# EAGLE design kmSigGenTiny_Schematics (EAGLE 9.4.2)
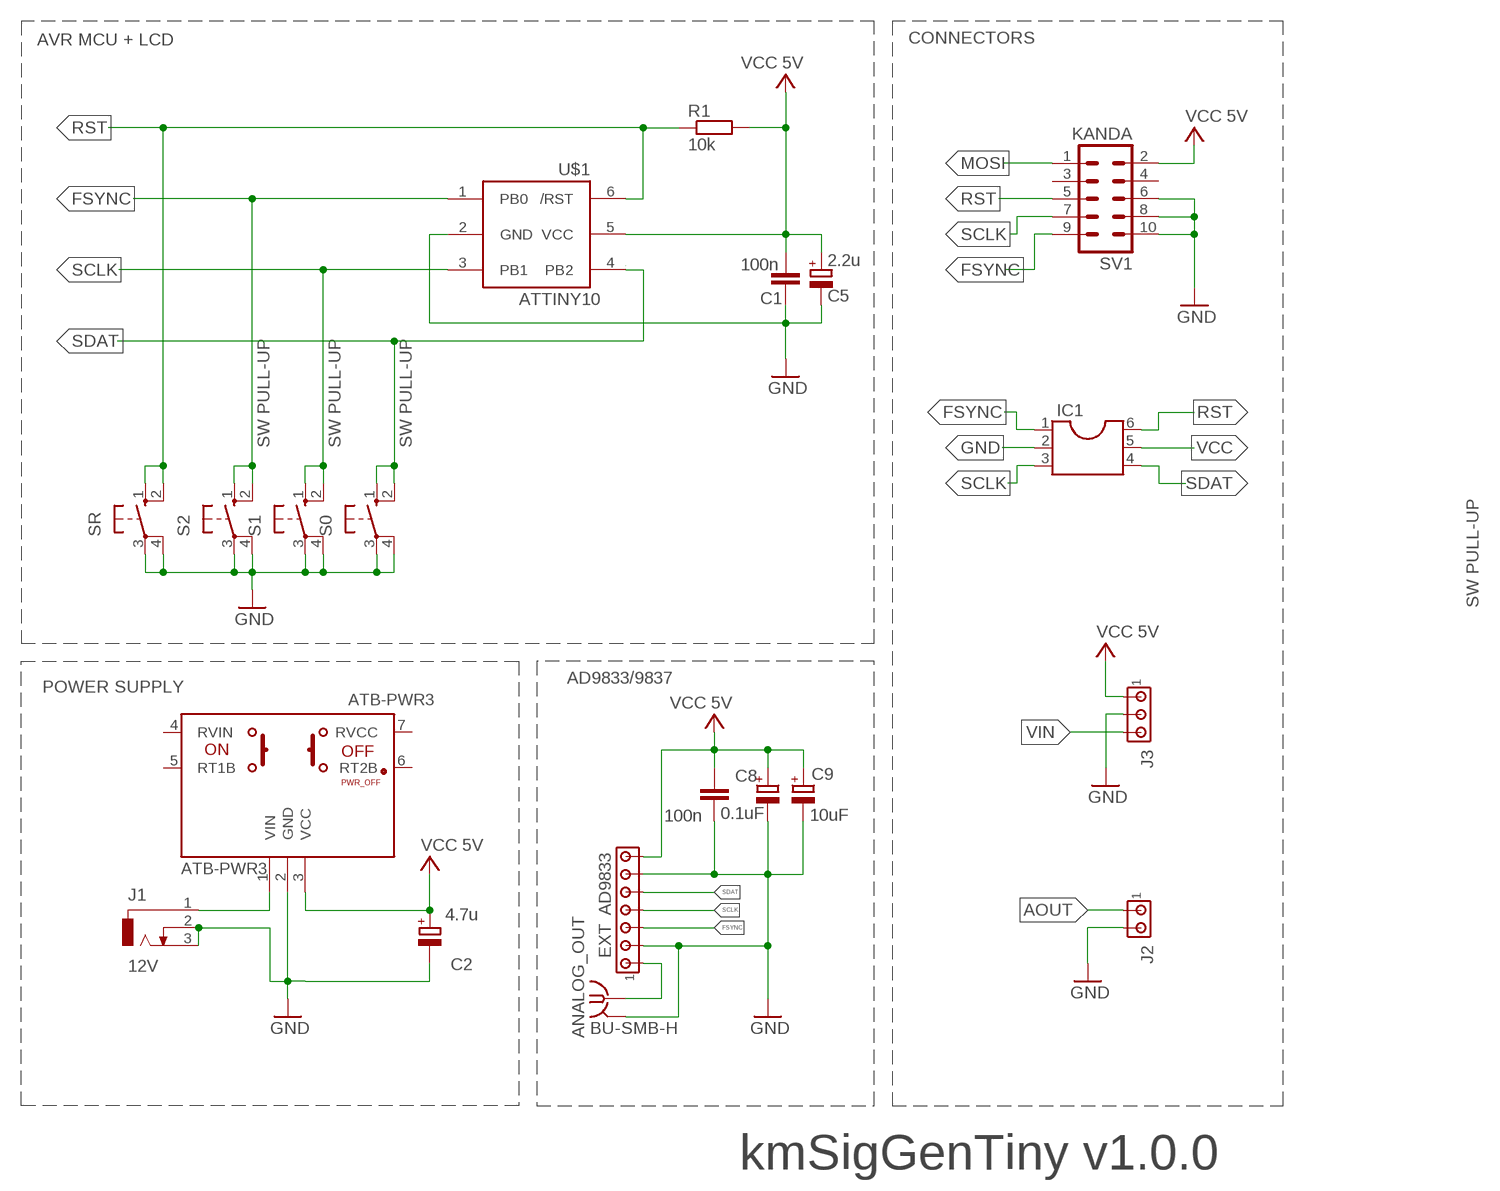
[diagram p0: schematic, sheet 1]

## Parts
ANALOG_OUT  BU-SMB-H  [BU-SMB-H]
ATB-PWR3  ATB-PWR3  [ATB-PWR3]
C1  100n  C2.5/4  [C2.5-4]
C2  4.7u  CPOL-EUB45181B  [B45181B]
C3  100n  C2.5/4  [C2.5-4]
C5  2.2u  CPOL-EUB45181B  [B45181B]
C8  0.1uF  CPOL-EUB45181B  [B45181B]
C9  10uF  CPOL-EUB45181B  [B45181B]
EXT  AD9833  MTA07-100  [10X07MTA]
IC1  DIL6  [DIL06]
J1  12V  DCJ0303  [DCJ0303]
J2  MTA02-100  [10X02MTA]
J3  MTA03-100  [10X03MTA]
R1  10k  R-EU_0207/10  [0207/10]
S0  10-XX  [B3F-10XX]
S1  10-XX  [B3F-10XX]
S2  10-XX  [B3F-10XX]
SR  10-XX  [B3F-10XX]
SV1  KANDA  ML10  [ML10]
U$1  ATTINY10  [SOT23-6]

## Nets
AOUT: ANALOG_OUT.1 EXT.1 J2.1
FSYNC: EXT.3 IC1.1 S2.1(S) S2.2(S1) SV1.9 U$1.1(PB0)
GND: ANALOG_OUT.2 ANALOG_OUT.3 ANALOG_OUT.4 ANALOG_OUT.5 ATB-PWR3.2(GND) C1.1 C2.- C3.1 C5.- C8.- C9.- EXT.2 EXT.6 IC1.2 J1.2 J1.3 J2.2 J3.2 S0.3(P) S0.4(P1) S1.3(P) S1.4(P1) S2.3(P) S2.4(P1) SR.3(P) SR.4(P1) SV1.6 SV1.8 SV1.10 U$1.2(GND)
MOSI: SV1.1
RST: IC1.6 R1.1 SR.1(S) SR.2(S1) SV1.5 U$1.6(/RST)
SCLK: EXT.4 IC1.3 S1.1(S) S1.2(S1) SV1.7 U$1.3(PB1)
SDAT: EXT.5 IC1.4 S0.1(S) S0.2(S1) U$1.4(PB2)
VCC: ATB-PWR3.3(VCC) C1.2 C2.+ C3.2 C5.+ C8.+ C9.+ EXT.7 IC1.5 J3.1 R1.2 SV1.2 U$1.5(VCC) ; supply symbol labelled VCC 5V
VIN: ATB-PWR3.1(VIN) J1.1 J3.3
Unconnected: ATB-PWR3.4(RVIN) ATB-PWR3.5(RT1B) ATB-PWR3.6(RT2B) ATB-PWR3.7(RVCC) SV1.3 SV1.4

## Notes on the sheet
- AVR MCU + LCD | CONNECTORS
- SW PULL-UP | SW PULL-UP | SW PULL-UP
- SW PULL-UP
- AD9833/9837
- POWER SUPPLY
- kmSigGenTiny v1.0.0

## Library data of the parts
ANALOG_OUT = con-coax:BU-SMB-H: FEMALE SMB CONNECTOR Radiall distributor RS 112-3003; OC_FARNELL: unknown; OC_NEWARK: unknown
ATB-PWR3 = _ATNEL:ATB-PWR3
C1 C3 = capacitor-wima:C: CAPACITOR naming: grid - package width
C2 C5 C8 C9 = rcl:CPOL-EU: POLARIZED CAPACITOR, European symbol; SPICEPREFIX: C
EXT = con-amp:MTA07-100: AMP connector
IC1 = ic-package:DIL6: Dual In Line / Socket
J1 = con-jack:DCJ0303: DC POWER JACK Source: DCJ0303.pdf; OC_FARNELL: unknown; OC_NEWARK: unknown
J2 = con-amp:MTA02-100: AMP connector
J3 = con-amp:MTA03-100: AMP connector
R1 = rcl:R-EU_: RESISTOR, European symbol; SPICEPREFIX: R
S0 S1 S2 SR = switch-omron:10-XX: OMRON SWITCH; MPN: B3F-1000; OC_FARNELL: 176432; OC_NEWARK: 36M3542
SV1 = con-ml:ML10: HARTING; OC_FARNELL: unknown; OC_NEWARK: unknown
U$1 = adafruit:ATTINY10: ATtiny4/5/9/10 8-bit Microcontroller with 512/1024 Bytes In-System Programmable Flash

## Board
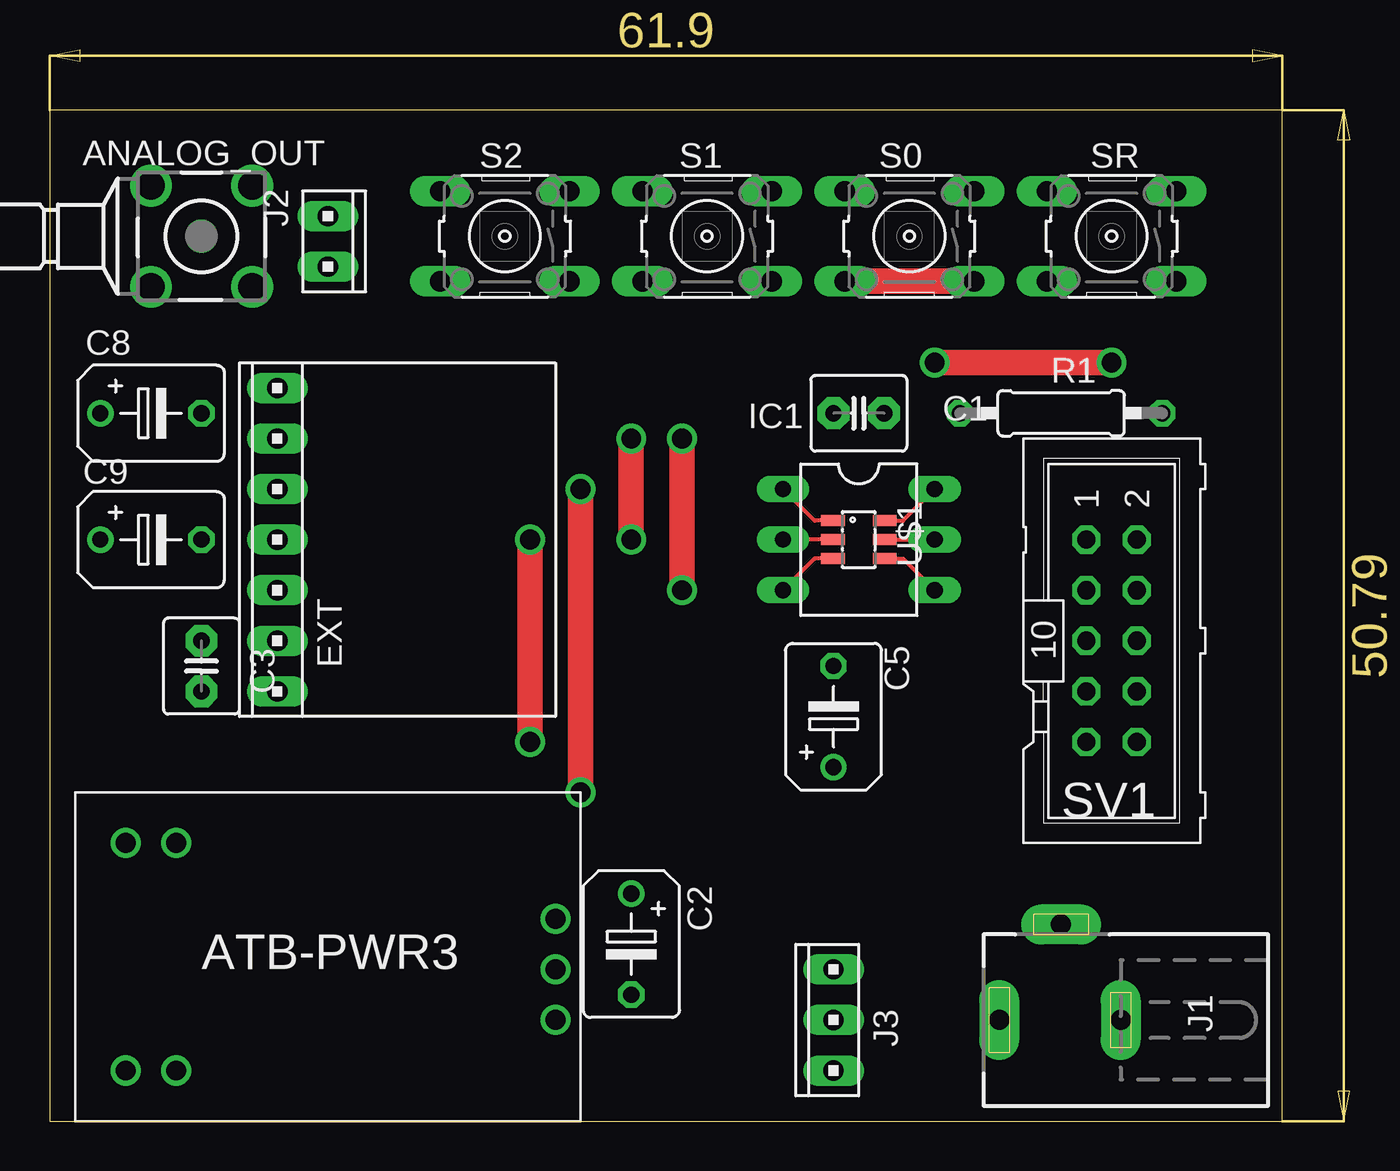
[diagram p1: board, top side]
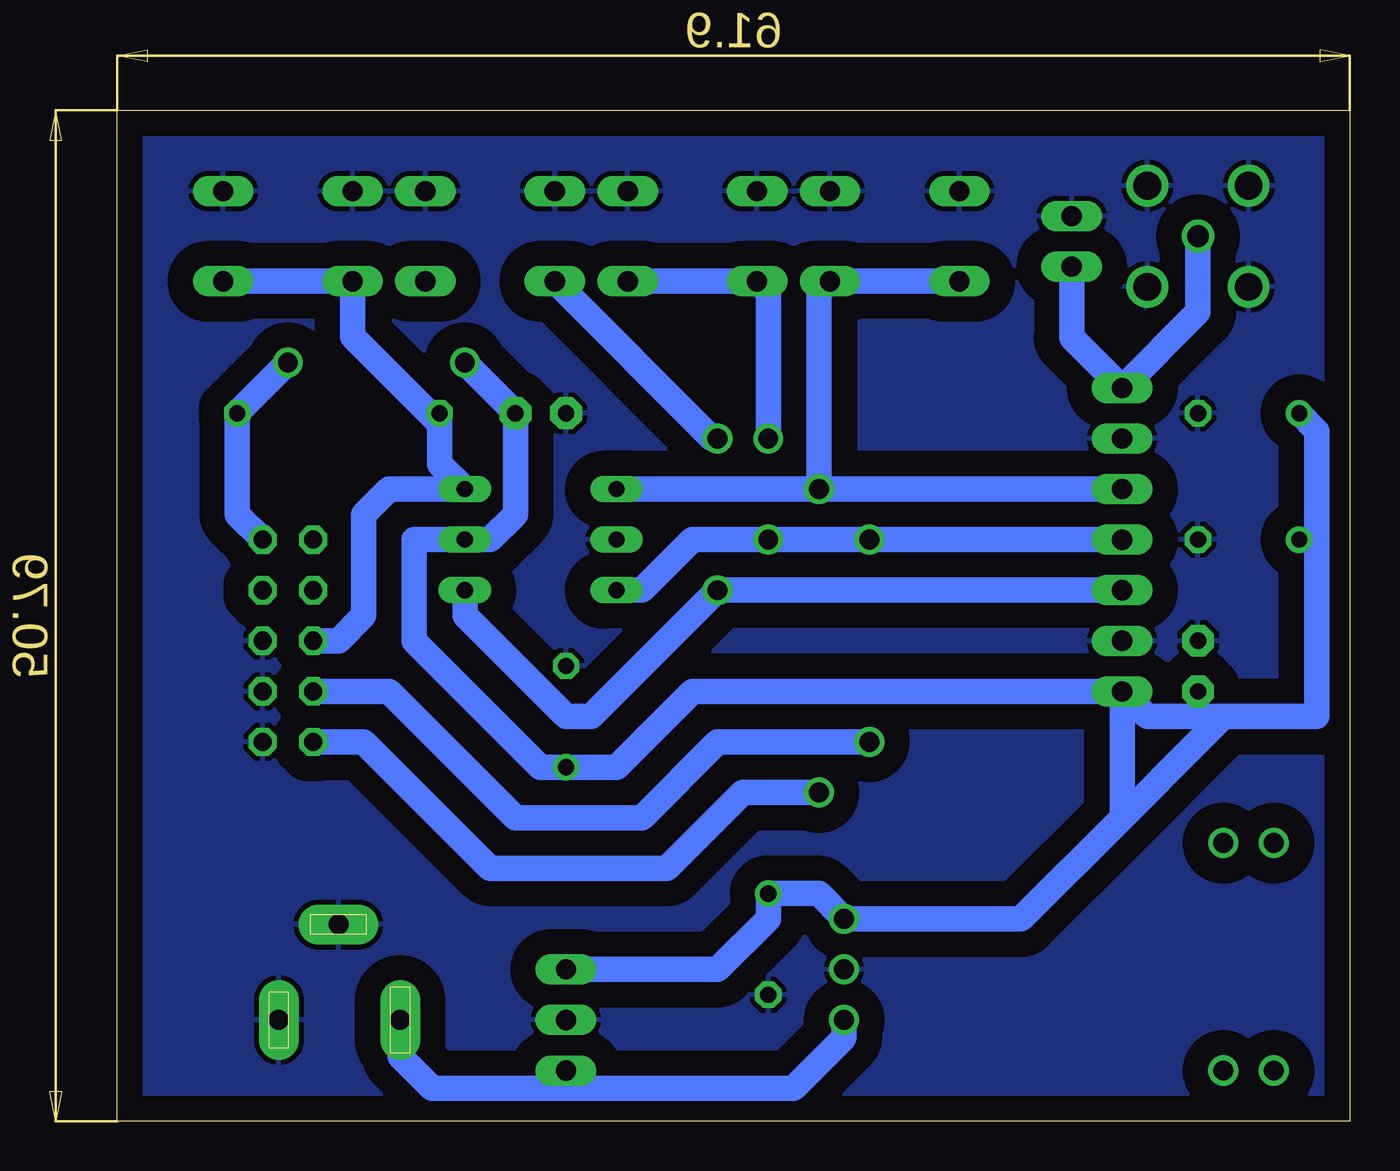
[diagram p2: board, bottom side, seen from below]

Size 61.9 x 50.79 mm. Coordinates in mm from the lower left corner, seen from the top.
Outline: 0,0 61.9,0 61.9,50.79 0,50.79 0,0
Copper layers (1*16): Top 0.035mm / dielectric 1.5mm / Bottom 0.035mm
Design rules "default": minimum track width 6mil, minimum drill 0.35mm, track to track 6mil, track to pad 6mil, pad to pad 6mil, via to via 6mil, smd to smd 6mil, copper to edge 40mil, drill to drill 6mil, minimum pad ring 10mil, minimum via ring 8mil, stop-mask expansion 4mil, vias tented up to drill 0mil, thermal gap 10mil

### Footprints (pad centres in the part's own frame; a part is rotated, then mirrored left to right if it is on the bottom)
BU-SMB-H = drill 1.1: 1 0,0 | drill 1.4: 2 -2.54,2.54; 3 2.54,2.54; 4 2.54,-2.54; 5 -2.54,-2.54
ATB-PWR3 = drill 1: 1 11.43,-3.81; 2 11.43,-1.27; 3 11.43,1.27; 4 -7.62,-6.35; 5 -10.16,-6.35; 6 -10.16,5.08; 7 -7.62,5.08
C2.5-4 = drill 0.813 pad 1.6 octagon: 1 -1.27,0; 2 1.27,0
B45181B = drill 0.813: + -2.54,0 | drill 0.813 octagon: - 2.54,0
10X07MTA = drill 1.016 long: 1 7.62,0; 2 5.08,0; 3 2.54,0; 4 0,0; 5 -2.54,0; 6 -5.08,0; 7 -7.62,0
DIL06 = drill 0.813 long: 1 -2.54,-3.81; 2 0,-3.81; 3 2.54,-3.81; 4 2.54,3.81; 5 0,3.81; 6 -2.54,3.81
DCJ0303 = drill 1 pad 2 long: 1 0,3.1; 2 4.8,0; 3 0,-3
10X02MTA = drill 1.016 long: 1 1.27,0; 2 -1.27,0
10X03MTA = drill 1.016 long: 1 2.54,0; 2 0,0; 3 -2.54,0
0207/10 = drill 0.813 octagon: 1 -5.08,0; 2 5.08,0
B3F-10XX = drill 1.016 long: 1 -3.251,2.261; 2 3.251,2.261; 3 -3.251,-2.261; 4 3.251,-2.261
ML10 = drill 0.914 octagon: 1 -5.08,-1.27; 2 -5.08,1.27; 3 -2.54,-1.27; 4 -2.54,1.27; 5 0,-1.27; 6 0,1.27; 7 2.54,-1.27; 8 2.54,1.27; 9 5.08,-1.27; 10 5.08,1.27
SOT23-6 = smd 0.55 x 1.2: 1 -0.95,-1.3; 2 0,-1.3; 3 0.95,-1.3; 4 0.95,1.3; 5 0,1.3; 6 -0.95,1.3

### Placement (x,y rotation side)
ANALOG_OUT  7.62,44.45 180 top
ATB-PWR3  13.97,8.89 0 top
C1  40.64,35.56 0 top
C2  29.21,8.89 270 top
C3  7.62,22.86 270 top
C5  39.37,20.32 90 top
C8  5.08,35.56 0 top
C9  5.08,29.21 0 top
EXT  11.43,29.21 90 top
IC1  40.64,29.21 270 top
J1  50.8,5.08 90 top
J2  13.97,44.2 270 top
J3  39.37,5.08 90 top
R1  50.8,35.56 0 top
S0  43.18,44.45 180 top
S1  33.02,44.45 180 top
S2  22.86,44.45 180 top
SR  53.34,44.45 180 top
SV1  53.34,24.13 270 top
U$1  40.64,29.21 270 top

### Tracks (layer width: path | path; a pad name or v marks a point on that pad's centre or on a via)
AOUT
  Bottom 1.27: ANALOG_OUT.1 7.62,40.64 EXT.1 13.97,39.37 J2.1
FSYNC  (via drill 1)
  Top 0.203: U$1.1 38.42,30.16 IC1.1
  Top 1.27: v26.67,31.75 v26.67,16.51
  Bottom 1.27: EXT.3 19.05,31.75 v26.67,31.75 | v26.67,31.75 IC1.1 | S2.2 S2.1 26.67,41.63 v26.67,31.75 | SV1.9 49.53,19.05 43.18,12.7 34.29,12.7 30.48,16.51 v26.67,16.51
GND
  Top 0.203: U$1.2 IC1.2
  pour Bottom (isolate 1.27): 0,49.53 63.5,49.53 63.5,0 0,0
RST
  Top 0.203: U$1.6 42.86,30.16 IC1.6
  Bottom 1.27: 45.72,35.05 50.09,39.42 SR.2 SR.1 | 45.72,35.05 45.72,33.78 45.72,33.02 IC1.6 46.99,31.75 48.26,31.75 49.53,30.48 49.53,25.4 50.8,24.13 SV1.5 | R1.1 45.72,35.05
SCLK  (via drill 1)
  Top 0.203: U$1.3 38.42,28.26 IC1.3
  Top 1.27: v29.21,34.29 v29.21,29.21 | v24.13,29.21 v24.13,19.05
  Bottom 1.27: S1.1 S1.2 29.21,41.63 v29.21,34.29 | SV1.7 48.26,21.59 41.91,15.24 35.56,15.24 31.75,19.05 v24.13,19.05 | EXT.4 v24.13,29.21 v29.21,29.21 33.02,29.21 35.56,26.67 IC1.3
SDAT  (via drill 1)
  Top 0.203: U$1.4 42.86,28.26 IC1.4
  Top 1.27: v31.75,34.29 v31.75,26.67 | S0.2 S0.1
  Bottom 1.27: v31.75,34.29 32.03,34.29 S0.2 | EXT.5 v31.75,26.67 38.1,20.32 39.37,20.32 44.45,25.4 IC1.4
VCC  (via drill 1)
  Top 0.203: U$1.5 IC1.5
  Top 1.27: v53.34,38.1 v44.45,38.1
  Bottom 0.203: C3.2 7.62,19.05
  Bottom 1.27: 1.65,29.21 1.65,22.86 1.65,20.32 6.35,20.32 | 1.65,29.21 1.65,34.67 C8.+ | C9.+ 1.65,29.21 | 11.43,15.24 11.43,20.32 EXT.7 | 11.43,15.24 16.51,10.16 ATB-PWR3.3 26.67,11.43 C2.+ 29.21,10.16 31.75,7.62 J3.1 | 11.43,15.24 7.62,19.05 6.35,20.32 | SV1.2 55.88,30.48 R1.2 v53.34,38.1 | v44.45,38.1 C1.2 41.91,30.48 43.18,29.21 IC1.5 46.99,29.21 46.99,24.13 40.64,17.78 C5.+ 36.83,17.78 33.02,21.59 EXT.7 | EXT.7 10.16,20.32 6.35,20.32
VIN
  Bottom 1.27: J1.1 47.7,3.25 46.1,1.65 39.37,1.65 | ATB-PWR3.1 25.4,4.19 27.94,1.65 39.37,1.65 | J3.3 39.37,1.65

### Text on the board
tNames: ATB-PWR3